# Altium schematic sheet ne555_pwm_motor.SchDoc
size A
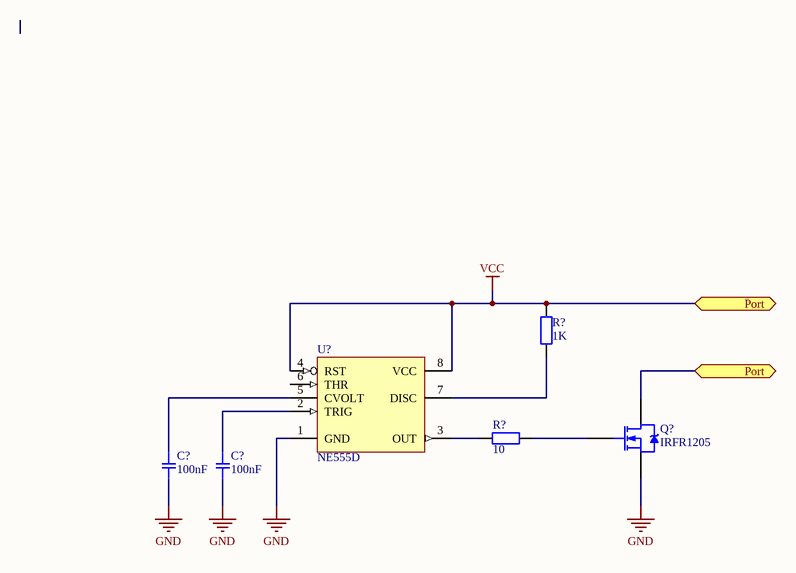
[diagram p0: ne555_pwm_motor.SchDoc]

## Parts
(Parts that share a designator on the sheet are numbered #1, #2 ... from top to bottom, then left to right.)
C?#1  100nF  [SMD-0805C]
C?#2  100nF  [SMD-0805C]
Q?  IRFR1205  [TO-252AA_M]
R?#1  value 1K  [0805-2]  (hidden comment: Res1)
R?#2  value 10  [0805-2]  (hidden comment: Res1)
U?  NE555D  [D008_N]

## Ports
Port

## Nets
GND: C?#1.2 C?#2.2 Q?.3(S) U?.1(GND)
VCC: Q?.4(D) R?#1.2 U?.4(RST) U?.8(VCC) ; port Port
NetC?#1_1: C?#1.1 U?.5(CVOLT)
NetC?#2_1: C?#2.1 U?.2(TRIG)
NetQ?_1: Q?.1(G) R?#2.1
NetR?#1_1: R?#1.1 U?.7(DISC)
NetR?#2_2: R?#2.2 U?.3(OUT)

Not connected (* = marked no-connect by the designer): U? 6(THR)

## Library data of the parts
C?#1 C?#2 = GC321AD72E103KX01D: CAP CER 100nF; Manufacturer: Murata Electronics North America; Factory Stock: 0; Unit Price (USD): 0.3; Minimum Quantity: 1; Tolerance: ±10%; Voltage: 250V; Temperature Coefficient: X7T; Datasheets: http://search.murata.co.jp/Ceramy/image/img/A01X/G101/ENG/GC321AD72E103KX01-01.pdf; Image: //media.digikey.com/Renders/Murata%20Renders/0805(GC3)200x125.jpg; Digi-Key Part Number: 490-13986-1-ND; Part Number: GC321AD72E103KX01D; Quantity Available: 4000; @ qty: 0; Packaging: Cut Tape (CT); Series: GC3; Part Status: Active; Value: 100nF; Operating Temperature: -55°C ~ 125°C; Features: -; Ratings: AEC-Q200; Applications: Automotive; Mounting Type: Surface Mount, MLCC; Package / Case: 0805 (2012 Metric); Size / Dimension: 0.079" L x 0.049" W (2.00mm x 1.25mm); Height - Seated (Max): -; Thickness (Max): 0.039" (1.00mm); Lead Spacing: -; Lead Style: -
Q? = IRFR1205: HEXFET Power MOSFET; Note: Pin 2 is trimmed and is electrically connected to Drain.; Published: 8-Jun-2000; LatestRevisionDate: 20-Nov-2009; LatestRevisionNote: IPC-7351 Footprint Added.; DatasheetVersion: PD-91318B; PackageVersion: Feb-2003; PackageReference: TO-252AA; Publisher: Altium Limited; PackageDescription: 3-Pin HEXFET Package 2.28 mm Pitch, 9.9 mm Lead Span; Code_JEDEC: TO-252-AA; ComponentLink1Description: Manufacturer Link; ComponentLink1URL: http://www.irf.com/; ComponentLink2Description: Datasheet; ComponentLink2URL: http://www.irf.com/product-info/datasheets/data/irfr1205.pdf
R?#1 R?#2 = Res1: 贴片电阻; Published: 8-Jun-2000; LatestRevisionDate: 17-Jul-2002; LatestRevisionNote: Re-released for DXP Platform.; PackageReference: AXIAL-0.4; Publisher: Altium Limited
U? = NE555D: Precision Timer; Published: 16-Jan-2001; LatestRevisionDate: 13-Apr-2006; LatestRevisionNote: IPC-7351 Footprint Added.; DatasheetVersion: Feb-1992; PackageVersion: Jan-1998; PackageReference: D008; Publisher: Altium Limited; PackageDescription: 8-Pin Small Outline Integrated Circuit 1.27 mm Pitch; Code_IPC: SOIC127P600-8; ComponentLink1Description: Manufacturer Link; ComponentLink1URL: http://www.ti.com/; ComponentLink2Description: Datasheet; ComponentLink2URL: http://www-s.ti.com/sc/ds/ne555.pdf